# Altium schematic sheet CT310高端控制盒左摇杆电路V1.0.SchDoc
size A4
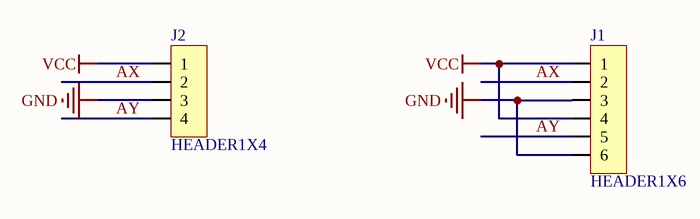
[diagram p0: CT310高端控制盒左摇杆电路V1.0.SchDoc]

## Parts
J1  HEADER1X6  [H20JH]
J2  HEADER1X4  [ZH1X4WT-1.5]

## Nets
GND: J1.3 J1.6 J2.3
VCC: J1.1 J1.4 J2.1
AX: J1.2 J2.2
AY: J1.5 J2.4